# EAGLE design rev2 (EAGLE 9.5.1)
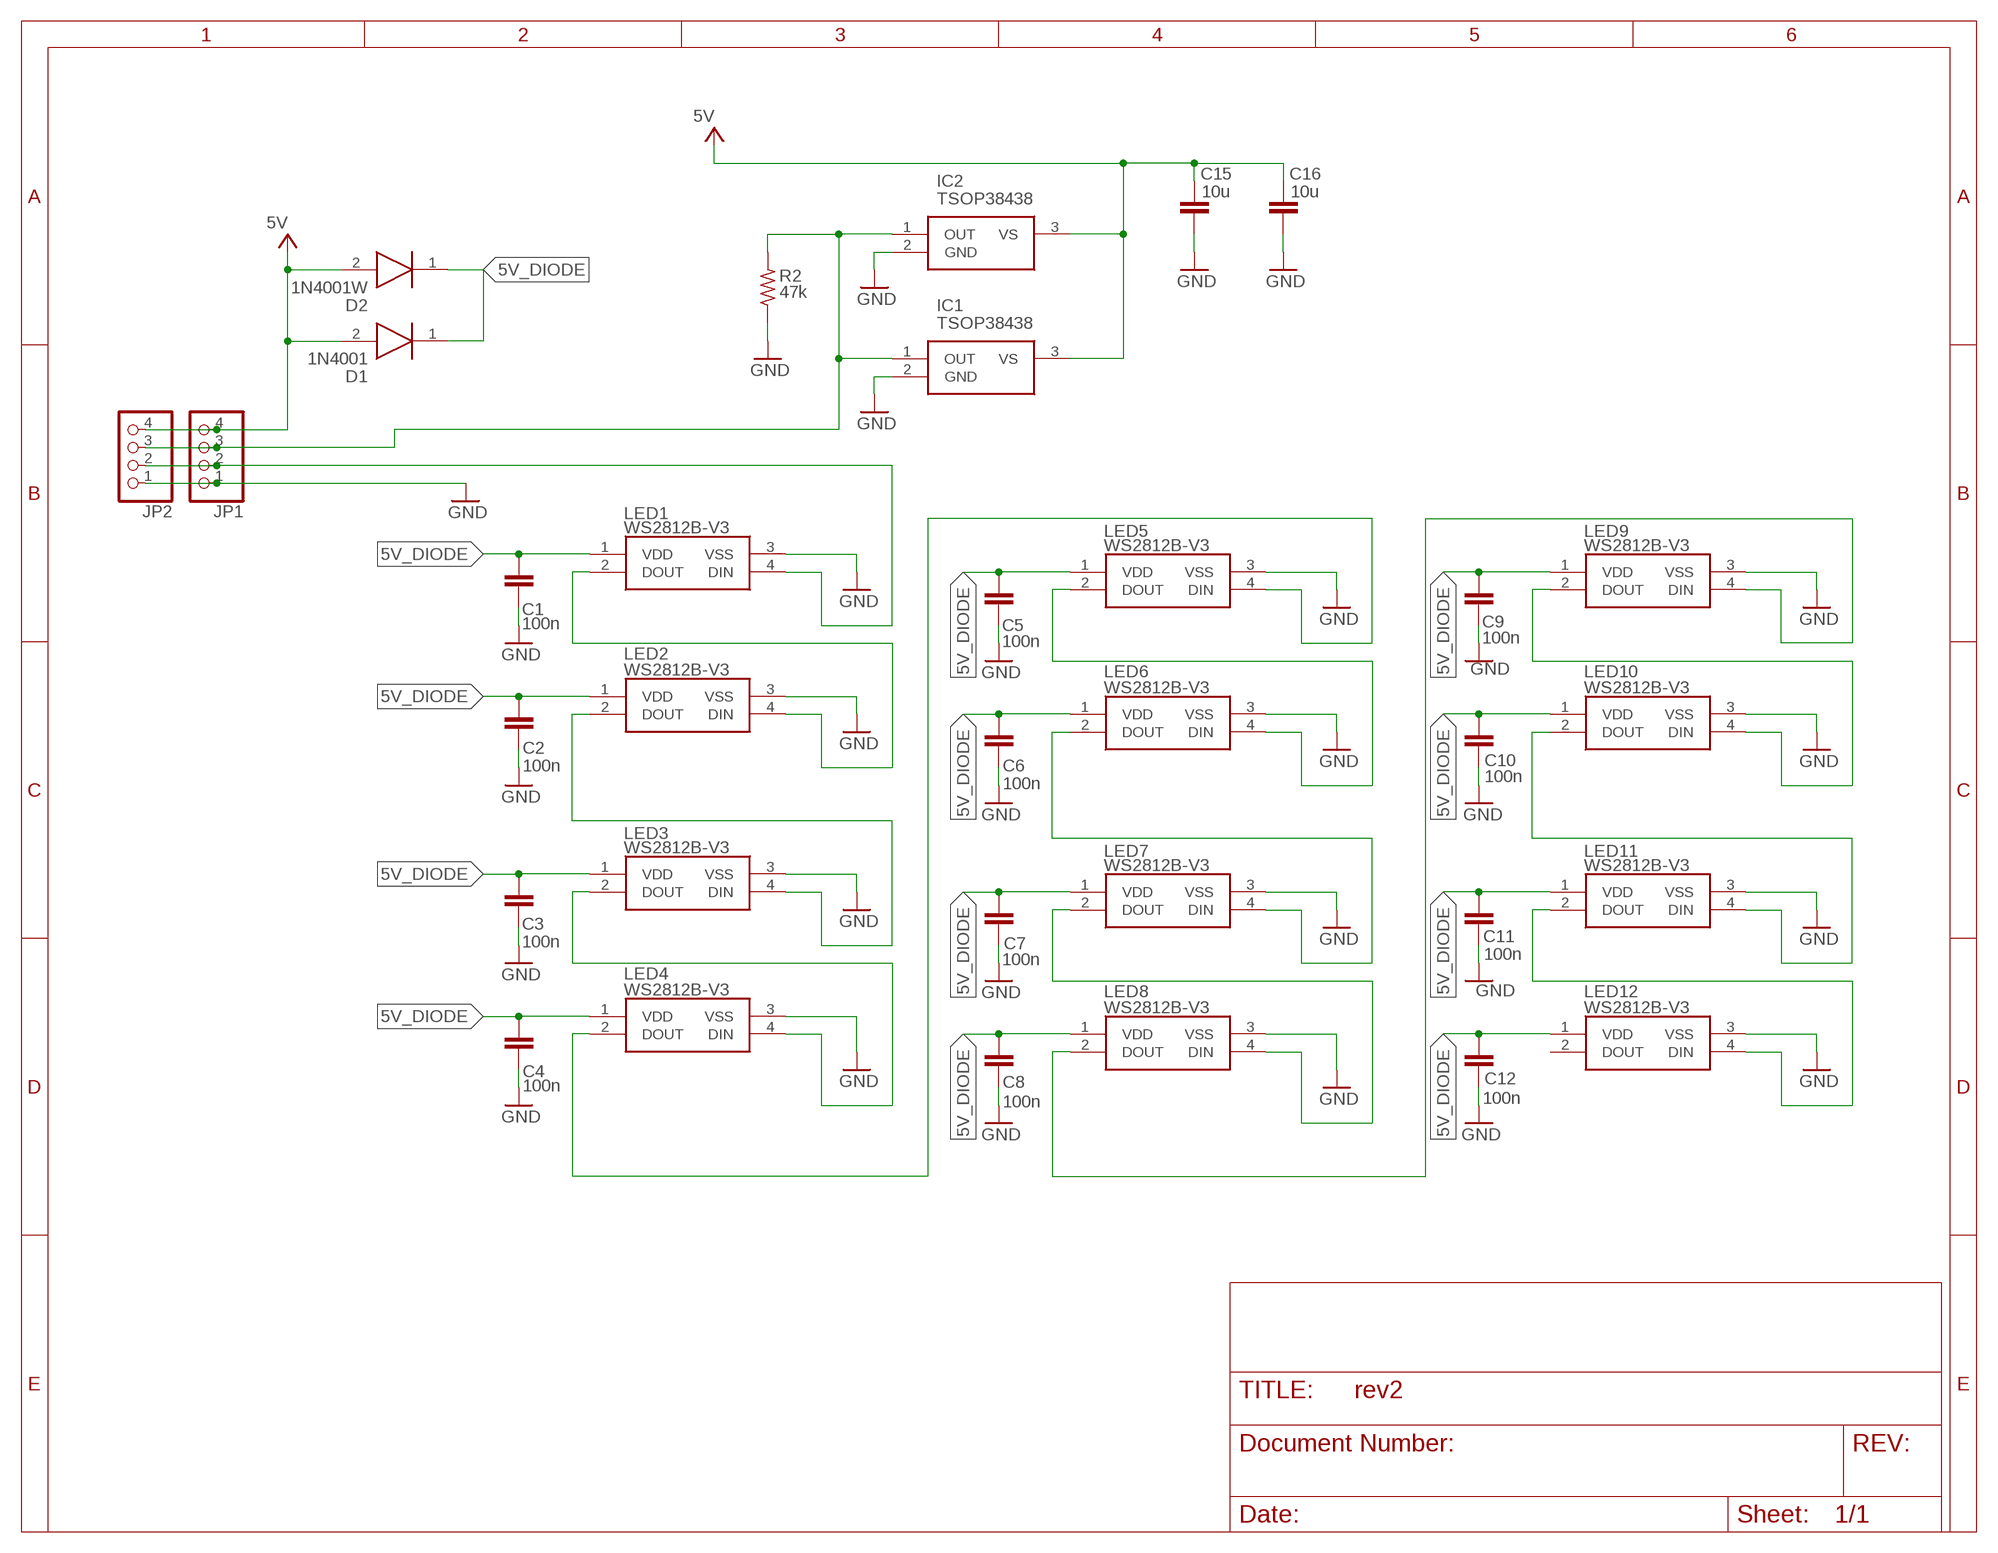
[diagram p0: schematic, sheet 1]

## Parts
C1  100n  CAP_SMD0805  [C0805]
C2  100n  CAP_SMD0805  [C0805]
C3  100n  CAP_SMD0805  [C0805]
C4  100n  CAP_SMD0805  [C0805]
C5  100n  CAP_SMD0805  [C0805]
C6  100n  CAP_SMD0805  [C0805]
C7  100n  CAP_SMD0805  [C0805]
C8  100n  CAP_SMD0805  [C0805]
C9  100n  CAP_SMD0805  [C0805]
C10  100n  CAP_SMD0805  [C0805]
C11  100n  CAP_SMD0805  [C0805]
C12  100n  CAP_SMD0805  [C0805]
C15  10u  CAP_SMD0805  [C0805]
C16  10u  CAP_SMD0805  [C0805]
D1  1N4001  [DIOAD1405W86L465D235]
D2  1N4001W  [1N4001W]
IC1  TSOP38438  [TSOP38238]
IC2  TSOP38438  [TSOP38238]
JP1  PINHD-1X4  [1X04]
JP2  PINHD-1X4  [1X04]
LED1  WS2812B-V3  [WS2812BV3]
LED2  WS2812B-V3  [WS2812BV3]
LED3  WS2812B-V3  [WS2812BV3]
LED4  WS2812B-V3  [WS2812BV3]
LED5  WS2812B-V3  [WS2812BV3]
LED6  WS2812B-V3  [WS2812BV3]
LED7  WS2812B-V3  [WS2812BV3]
LED8  WS2812B-V3  [WS2812BV3]
LED9  WS2812B-V3  [WS2812BV3]
LED10  WS2812B-V3  [WS2812BV3]
LED11  WS2812B-V3  [WS2812BV3]
LED12  WS2812B-V3  [WS2812BV3]
R2  47k  RES_SMD0805  [R0805]

## Nets
5V: C15.2 C16.2 D1.2(A) D2.2(A) IC1.3(VS) IC2.3(VS) JP1.4 JP2.4
5V_DIODE: C1.2 C2.1 C3.2 C4.1 C5.2 C6.1 C7.2 C8.1 C9.2 C10.1 C11.2 C12.1 D1.1(K) D2.1(K) LED1.1(VDD) LED2.1(VDD) LED3.1(VDD) LED4.1(VDD) LED5.1(VDD) LED6.1(VDD) LED7.1(VDD) LED8.1(VDD) LED9.1(VDD) LED10.1(VDD) LED11.1(VDD) LED12.1(VDD)
GND: C1.1 C2.2 C3.1 C4.2 C5.1 C6.2 C7.1 C8.2 C9.1 C10.2 C11.1 C12.2 C15.1 C16.1 IC1.2(GND) IC2.2(GND) JP1.1 JP2.1 LED1.3(VSS) LED2.3(VSS) LED3.3(VSS) LED4.3(VSS) LED5.3(VSS) LED6.3(VSS) LED7.3(VSS) LED8.3(VSS) LED9.3(VSS) LED10.3(VSS) LED11.3(VSS) LED12.3(VSS) R2.1
N$1: LED1.2(DOUT) LED2.4(DIN)
N$2: IC1.1(OUT) IC2.1(OUT) JP1.3 JP2.3 R2.2
N$3: JP1.2 JP2.2 LED1.4(DIN)
N$4: LED3.2(DOUT) LED4.4(DIN)
N$8: LED2.2(DOUT) LED3.4(DIN)
N$9: LED5.2(DOUT) LED6.4(DIN)
N$12: LED4.2(DOUT) LED5.4(DIN)
N$13: LED7.2(DOUT) LED8.4(DIN)
N$16: LED6.2(DOUT) LED7.4(DIN)
N$17: LED9.2(DOUT) LED10.4(DIN)
N$20: LED8.2(DOUT) LED9.4(DIN)
N$21: LED11.2(DOUT) LED12.4(DIN)
N$24: LED10.2(DOUT) LED11.4(DIN)
Unconnected: LED12.2(DOUT)

## Library data of the parts
C1-C12 C15 C16 = passives:CAP_SMD
D1 = WS2812B-V3:1N4001: Vishay 1N4001 Diode, 50V 1A, 2-Pin DO-204AL Source: Datasheet <https://www.vishay.com/docs/88503/1n4001.pdf>; DESCRIPTION: Vishay 1N4001 Diode, 50V 1A, 2-Pin DO-204AL; HEIGHT: mm; MANUFACTURER_NAME: Vishay; MANUFACTURER_PART_NUMBER: 1N4001; RS_PART_NUMBER: 0261148A; RS_PRICE-STOCK: http://uk.rs-online.com/web/p/products/0261148A
D2 = WS2812B-V3:1N4001W: diode Source: Datasheet <https://datasheet.lcsc.com/szlcsc/Shandong-Jingdao-Microelectronics-1N4001W_C162732.pdf>; DESCRIPTION: diode; HEIGHT: 1.1mm; MANUFACTURER_NAME: Shandong Jingdao Microelectronics; MANUFACTURER_PART_NUMBER: 1N4001W
IC1 IC2 = WS2812B-V3:TSOP38438: IR Remote Receiver 38KHz 45m Source: Datasheet <http://www.vishay.com/docs/82491/tsop382.pdf>; ALLIED_NUMBER: R1084632; ALLIED_PRICE-STOCK: https://www.alliedelec.com/vishay-dale-tsop38438/R1084632/; DESCRIPTION: IR Remote Receiver 38KHz 45m; HEIGHT: mm; MANUFACTURER_NAME: Vishay; MANUFACTURER_PART_NUMBER: TSOP38438; MOUSER_PART_NUMBER: 78-TSOP38438; MOUSER_PRICE-STOCK: https://www.mouser.com/Search/Refine.aspx?Keyword=78-TSOP38438; RS_PART_NUMBER: 7085092P; RS_PRICE-STOCK: http://uk.rs-online.com/web/p/products/7085092P
JP1 JP2 = WS2812B-V3:PINHD-1X4: PIN HEADER
LED1-LED12 = WS2812B-V3:WS2812B-V3: Light Emitting Diodes (LED) RGB 620~630nm Red, 515~530nm Green, 465~475nm Blue 550~700mcd@20mA Red, 1100~1400mcd@20mA Green, 200~400mcd@20mA Blue Top View 5050 RoHS Source: Datasheet <https://datasheet.lcsc.com/szlcsc/Worldsemi-WS2812B_C114585.pdf>; DESCRIPTION: Light Emitting Diodes (LED) RGB 620~630nm Red, 515~530nm Green, 465~475nm Blue 550~700mcd@20mA Red, 1100~1400mcd@20mA Green, 200~400mcd@20mA Blue Top View 5050 RoHS; HEIGHT: 1.62mm; MANUFACTURER_NAME: Worldsemi; MANUFACTURER_PART_NUMBER: WS2812B-V3
R2 = passives:RES_SMD

## Board
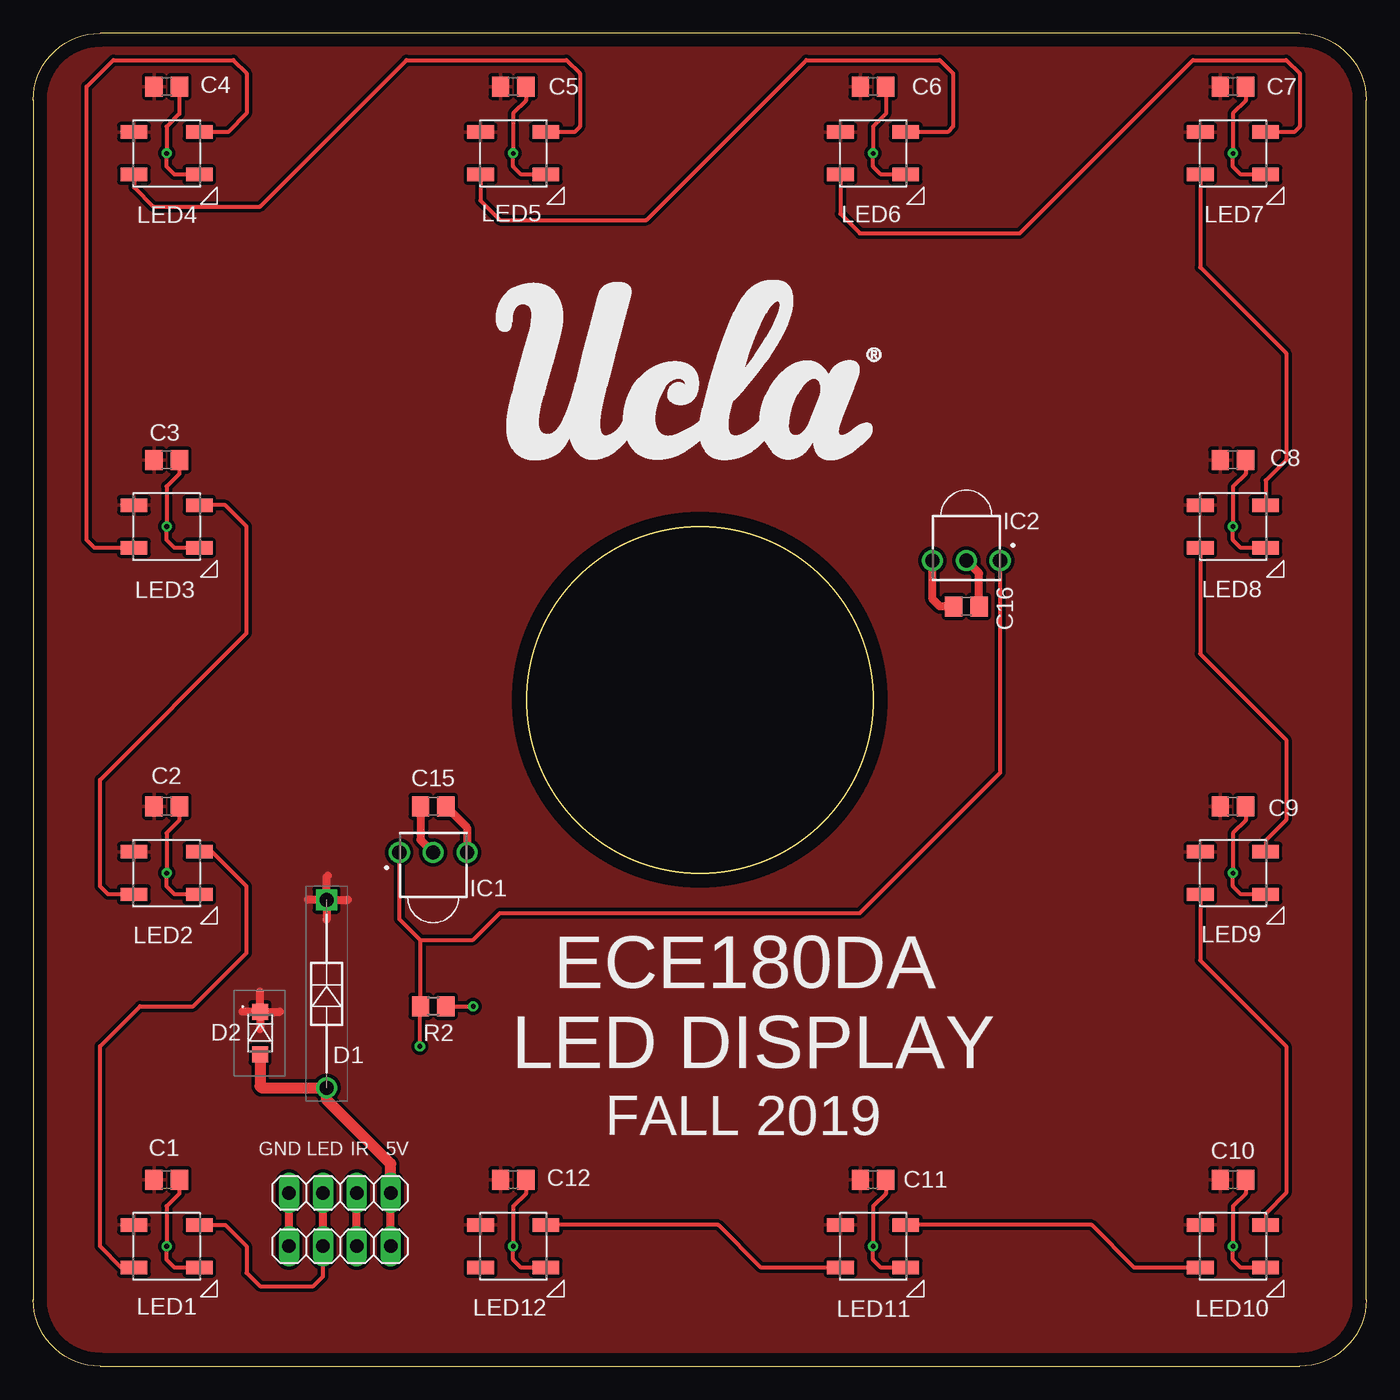
[diagram p1: board, top side]
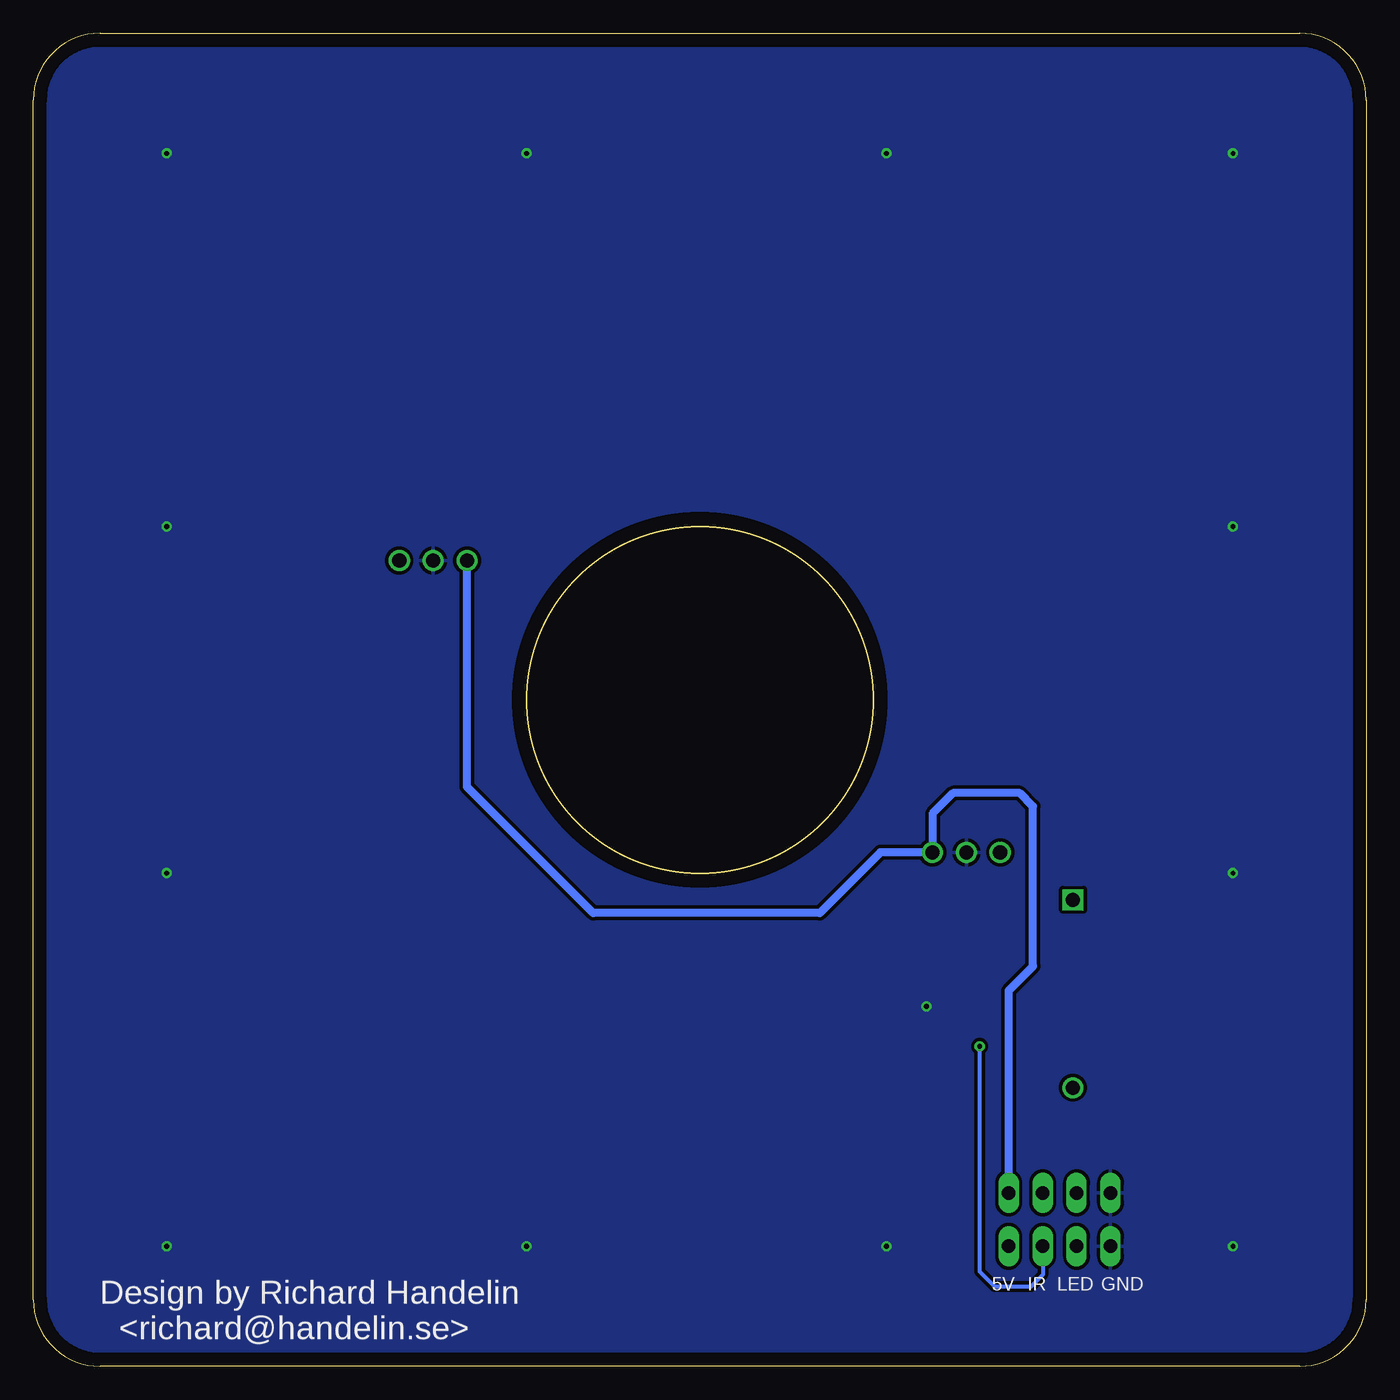
[diagram p2: board, bottom side, seen from below]

Size 100 x 100 mm. Coordinates in mm from the lower left corner, seen from the top.
Outline: 5,100 95,100 arc-90 100,95 100,5 arc-90 95,0 5,0 arc-90 0,5 0,95
Outline: 0,95 arc-90 5,100
Outline: 0,95 arc-90 5,100
Outline: circle at 50,50 radius 13
Copper layers (1*16): Top 0.035mm / dielectric 1.5mm / Bottom 0.035mm
Design rules "default *": minimum track width 6mil, minimum drill 0.35mm, track to track 10mil, track to pad 10mil, pad to pad 10mil, via to via 10mil, smd to smd 10mil, copper to edge 40mil, drill to drill 6mil, minimum pad ring 10mil, minimum via ring 8mil, stop-mask expansion 4mil, vias tented up to drill 0mil, thermal gap 10mil

### Footprints (pad centres in the part's own frame; a part is rotated, then mirrored left to right if it is on the bottom)
C0805 = smd 1.3 x 1.5: 1 -0.95,0; 2 0.95,0
DIOAD1405W86L465D235 = drill 1.05 pad 1.575 square: 1 0,0 | drill 1.05 pad 1.575: 2 14.1,0
1N4001W = smd 1.2 x 1.2: 1 -1.6,0; 2 1.6,0
TSOP38238 = drill 1.06 pad 1.56: 1 -2.54,-1.45; 2 0,-1.45; 3 2.54,-1.45
1X04 = drill 1.016 long: 1 -3.81,0; 2 -1.27,0; 3 1.27,0; 4 3.81,0
WS2812BV3 = smd 2 x 1: 1 -2.45,1.6; 2 -2.45,-1.6; 3 2.45,-1.6; 4 2.45,1.6
R0805 = smd 1.3 x 1.5: 1 -0.95,0; 2 0.95,0

### Placement (x,y rotation side)
C1  10,14 180 top
C2  10,42 0 top
C3  10,68 180 top
C4  10,96 0 top
C5  36,96 180 top
C6  63,96 0 top
C7  90,96 180 top
C8  90,68 0 top
C9  90,42 180 top
C10  90,14 0 top
C11  63,14 180 top
C12  36,14 0 top
C15  30,42 0 top
C16  70,57 180 top
D1  22,35 270 top
D2  17,25 270 top
IC1  30,40 0 top
IC2  70,59 180 top
JP1  23,9 0 top
JP2  23,13 0 top
LED1  10,9 0 top
LED2  10,37 0 top
LED3  10,63 0 top
LED4  10,91 0 top
LED5  36,91 0 top
LED6  63,91 0 top
LED7  90,91 0 top
LED8  90,63 0 top
LED9  90,37 0 top
LED10  90,9 0 top
LED11  63,9 0 top
LED12  36,9 0 top
R2  30,27 180 top

### Tracks (layer width: path | path; a pad name or v marks a point on that pad's centre or on a via)
5V
  Top 0.61: JP1.4 JP2.4 | C16.2 68,57 67.46,57.54 IC2.3 | C15.2 32.54,40.41 IC1.3
  Top 0.813: JP2.4 26.81,15.19 22,20 D1.2 17.1,20.9 17,21 D2.2
  Bottom 0.61: JP2.4 26.81,28.19 25,30 25,42 26,43 31,43 32.54,41.46 IC1.3 36.45,38.55 41,34 58,34 67.46,43.46 IC2.3
5V_DIODE
  Top 0.61: D1.1 22,36.7 22.1,36.8 | D1.1 22,33.5 | D1.1 23.6,35 | D1.1 20.6,35 | D2.1 17,28.1 | D2.1 18.5,26.6 | D2.1 15.7,26.6 | D2.1 17,25.3
  pour Top: 0,100 100,100 100,0 0,0
GND  (via drill 0.35)
  Top 0.305: C4.2 10.95,93.95 10,93 v10,91 10,90 10.6,89.4 LED4.3 | LED5.3 36.6,89.4 36,90 v36,91 36,94 36.95,94.95 C5.1 | C6.2 63.95,93.95 63,93 v63,91 63,90 63.6,89.4 LED6.3 | C7.1 90.95,94.95 90,94 v90,91 90,90 90.6,89.4 LED7.3 | C3.1 10.95,66.95 10,66 v10,63 10,62 10.6,61.4 LED3.3 | C8.2 90.95,66.95 90,66 v90,63 90,62 90.6,61.4 LED8.3 | C9.1 90.95,40.95 90,40 v90,37 90,36 90.6,35.4 LED9.3 | C10.2 90.95,12.95 90,12 v90,9 90,8 90.6,7.4 LED10.3 | LED11.3 63.6,7.4 63,8 v63,9 63,12 63.95,12.95 C11.1 | C12.2 36.95,12.95 36,12 v36,9 36,8 36.6,7.4 LED12.3 | C1.1 10.95,12.95 10,12 v10,9 10,8 10.6,7.4 LED1.3 | C2.2 10.95,40.95 10,40 v10,37 10,36 10.6,35.4 LED2.3 | R2.1 v33,27
  Top 0.61: JP1.1 JP2.1 | C16.1 70.95,59.5 IC2.2 | C15.1 29.05,39.5 IC1.2
  pour Bottom: 0,100 100,100 100,0 0,0
N$1
  Top 0.305: LED1.2 6.6,7.4 5,9 5,24 8,27 12,27 16,31 16,36 13.4,38.6 LED2.4
N$2  (via drill 0.35)
  Top 0.305: IC1.1 27.46,33.54 29,32 | 29,32 33,32 35,34 62,34 72.54,44.54 IC2.1 | v29,24 29,26.95 R2.2 29.05,31.95 29,32
  Top 0.61: JP1.3 JP2.3
  Bottom 0.305: v29,24 29,7.09 27.89,5.98 25.13,5.98 24.27,6.84 JP1.3
N$3
  Top 0.305: LED1.4 14.4,10.6 16,9 16,7 17,6 21,6 21.73,6.73 JP1.2
  Top 0.61: JP1.2 JP2.2
N$4
  Top 0.305: LED3.2 4.6,61.4 4,62 4,96 6,98 15,98 16,97 16,94 14.6,92.6 LED4.4
N$8
  Top 0.305: LED2.2 5.6,35.4 5,36 5,44 16,55 16,63 14.4,64.6 LED3.4
N$9
  Top 0.305: LED5.2 33.55,87.45 35,86 46,86 58,98 68,98 69,97 69,93 68.6,92.6 LED6.4
N$12
  Top 0.305: LED4.2 7.55,88.45 9,87 17,87 28,98 40,98 41,97 41,93 40.6,92.6 LED5.4
N$13
  Top 0.305: LED7.2 87.55,82.45 94,76 94,68 92.45,66.45 LED8.4
N$16
  Top 0.305: LED6.2 60.55,86.45 62,85 74,85 87,98 94,98 95,97 95,93 94.6,92.6 LED7.4
N$17
  Top 0.305: LED9.2 87.55,30.45 94,24 94,13 92.45,11.45 LED10.4
N$20
  Top 0.305: LED8.2 87.55,53.45 94,47 94,41 92.45,39.45 LED9.4
N$21
  Top 0.305: LED11.2 54.6,7.4 51.4,10.6 LED12.4
N$24
  Top 0.305: LED10.2 82.6,7.4 79.4,10.6 LED11.4

### Text on the board
tPlace: ECE180DA / LED DISPLAY | FALL 2019 | GND | LED | IR | 5V
bPlace: GND | LED | IR | 5V | Design by Richard Handelin / <richard@handelin.se>